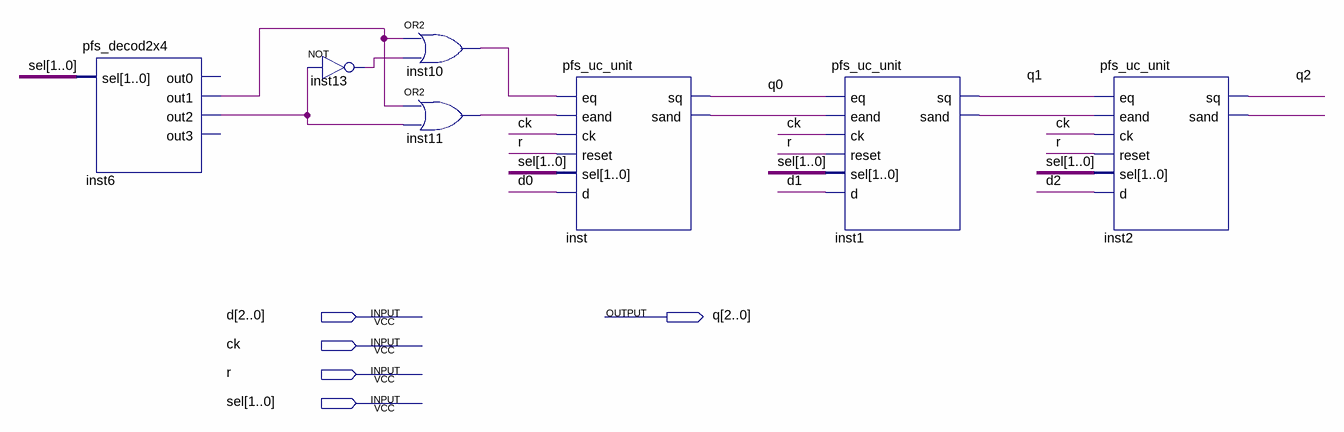
[diagram p0: schematic sheet]
// Quartus schematic pfs_count3.bdf as structural Verilog: 7 symbols, 5 pins
module pfs_count3 (
  input  [2:0] d,
  input  ck,
  input  r,
  input  [1:0] sel,
  output [2:0] q
);

  wire inst1_sand, inst2_sand, inst6_out1, inst6_out2, inst10_out, inst11_out, inst13_out, inst_sand;

  pfs_decod2x4 inst6 (.sel(sel), .out1(inst6_out1), .out2(inst6_out2));  // open: out0, out3
  not inst13 (inst13_out, inst6_out2);
  or inst10 (inst10_out, inst6_out1, inst13_out);
  or inst11 (inst11_out, inst6_out1, inst6_out2);
  pfs_uc_unit inst (
    .eq(inst10_out), .eand(inst11_out), .ck(ck), .reset(r), .sel(sel), .d(d[0]), .sq(q[0]), .sand(inst_sand));
  pfs_uc_unit inst1 (
    .eq(q[0]), .eand(inst_sand), .ck(ck), .reset(r), .sel(sel), .d(d[1]), .sq(q[1]), .sand(inst1_sand));
  pfs_uc_unit inst2 (
    .eq(q[1]), .eand(inst1_sand), .ck(ck), .reset(r), .sel(sel), .d(d[2]), .sq(q[2]), .sand(inst2_sand));
endmodule
